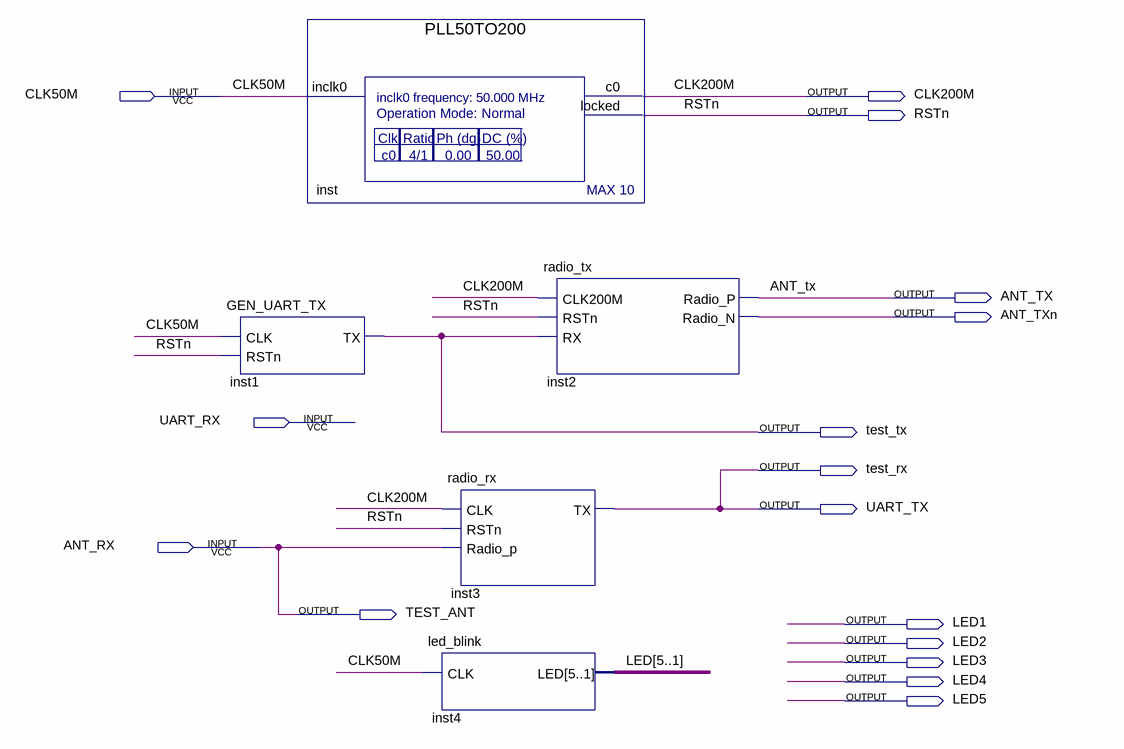
[diagram p0: schematic sheet]
// Quartus schematic MAX10_Modem.bdf as structural Verilog: 5 symbols, 16 pins
module MAX10_Modem (
  input  CLK50M,
  input  UART_RX,
  input  ANT_RX,
  output CLK200M,
  output RSTn,
  output ANT_TX,
  output ANT_TXn,
  output test_tx,
  output test_rx,
  output UART_TX,
  output TEST_ANT,
  output LED1,
  output LED2,
  output LED3,
  output LED4,
  output LED5
);

  GEN_UART_TX inst1 (.CLK(CLK50M), .RSTn(RSTn), .TX(test_tx));
  PLL50TO200 inst (.inclk0(CLK50M), .c0(CLK200M), .locked(RSTn));
  led_blink inst4 (.CLK(CLK50M), .LED({LED5, LED4, LED3, LED2, LED1}));
  radio_rx inst3 (.CLK(CLK200M), .RSTn(RSTn), .Radio_p(ANT_RX), .TX(test_rx));
  radio_tx inst2 (.CLK200M(CLK200M), .RSTn(RSTn), .RX(test_tx), .Radio_P(ANT_TX), .Radio_N(ANT_TXn));

  assign TEST_ANT = ANT_RX;
  assign UART_TX = test_rx;
endmodule
